# EAGLE design 2Timer (EAGLE 9.2.0)
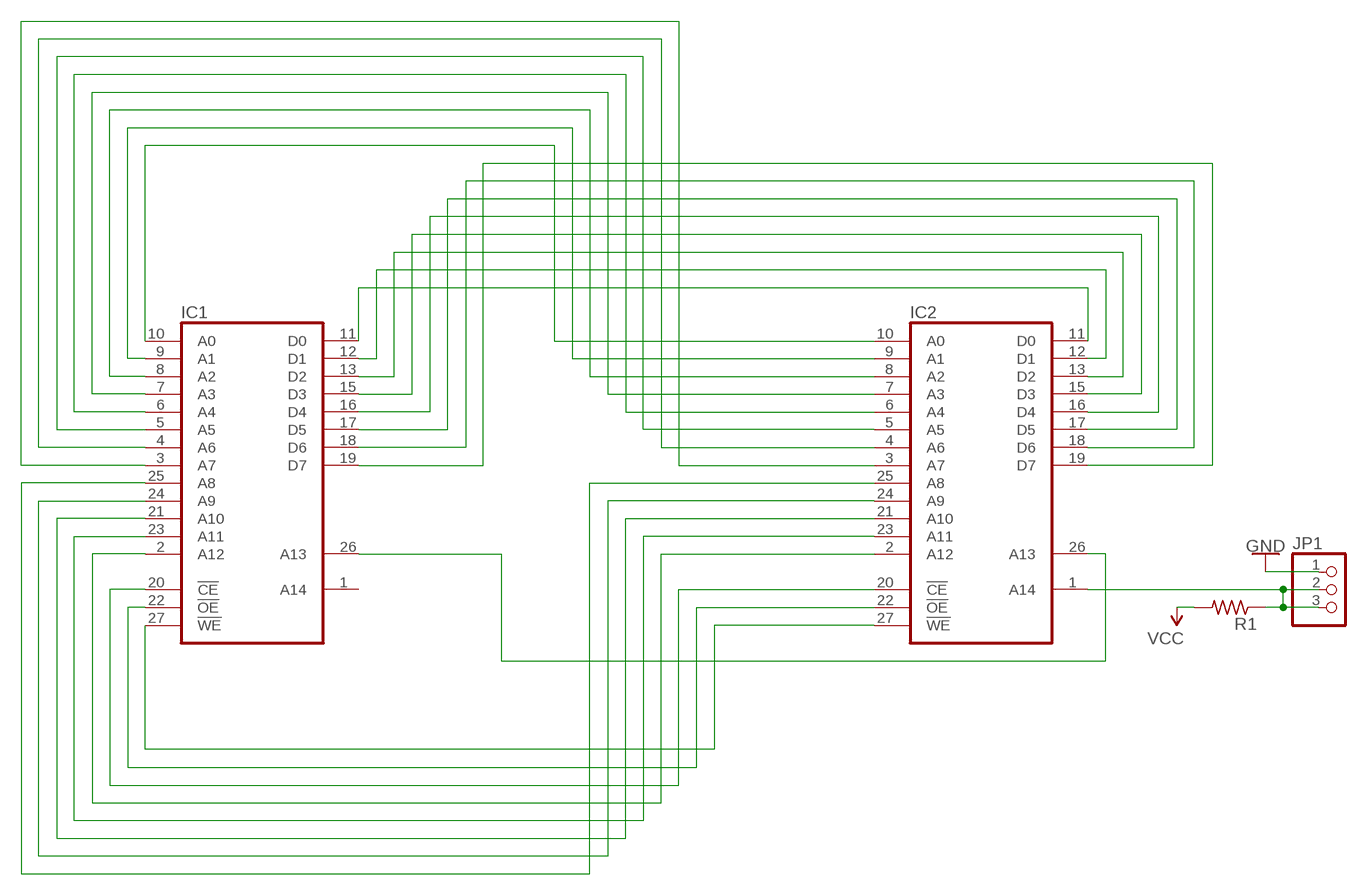
[diagram p0: schematic, sheet 1]

## Parts
IC1  2864  [DIL28]
IC2  2864  [DIL28]
JP1  PINHD-1X3/90  [1X03/90]
R1  R-US_0204/5  [0204/5]

## Nets
GND: JP1.1
N$1: IC1.20(!CE) IC2.20(!CE)
N$2: IC1.11(D0) IC2.11(D0)
N$3: IC1.12(D1) IC2.12(D1)
N$4: IC1.13(D2) IC2.13(D2)
N$5: IC1.23(A11) IC2.23(A11)
N$6: IC1.15(D3) IC2.15(D3)
N$7: IC1.16(D4) IC2.16(D4)
N$8: IC1.17(D5) IC2.17(D5)
N$9: IC1.18(D6) IC2.18(D6)
N$10: IC1.19(D7) IC2.19(D7)
N$11: IC1.26(A13) IC2.26(A13)
N$12: IC1.10(A0) IC2.10(A0)
N$13: IC1.9(A1) IC2.9(A1)
N$14: IC1.8(A2) IC2.8(A2)
N$15: IC1.7(A3) IC2.7(A3)
N$16: IC1.6(A4) IC2.6(A4)
N$17: IC1.5(A5) IC2.5(A5)
N$18: IC1.4(A6) IC2.4(A6)
N$19: IC1.3(A7) IC2.3(A7)
N$20: IC1.25(A8) IC2.25(A8)
N$21: IC1.24(A9) IC2.24(A9)
N$22: IC1.2(A12) IC2.2(A12)
N$23: IC1.21(A10) IC2.21(A10)
N$24: IC1.22(!OE) IC2.22(!OE)
N$25: IC1.27(!WE) IC2.27(!WE)
N$26: IC2.1(A14) JP1.2 JP1.3 R1.1
VCC: R1.2
Unconnected: IC1.1(A14)

## Power pins joined to a net without a drawn wire
GND: IC1.14(GND) IC2.14(GND)
VCC: IC1.28(VCC) IC2.28(VCC)

## Library data of the parts
IC1 IC2 = modded_memory:2864: MEMORY
JP1 = pinhead:PINHD-1X3: PIN HEADER
R1 = resistor:R-US_: RESISTOR, American symbol

## Net classes
0 default: clearance 0.205 mm

## Board
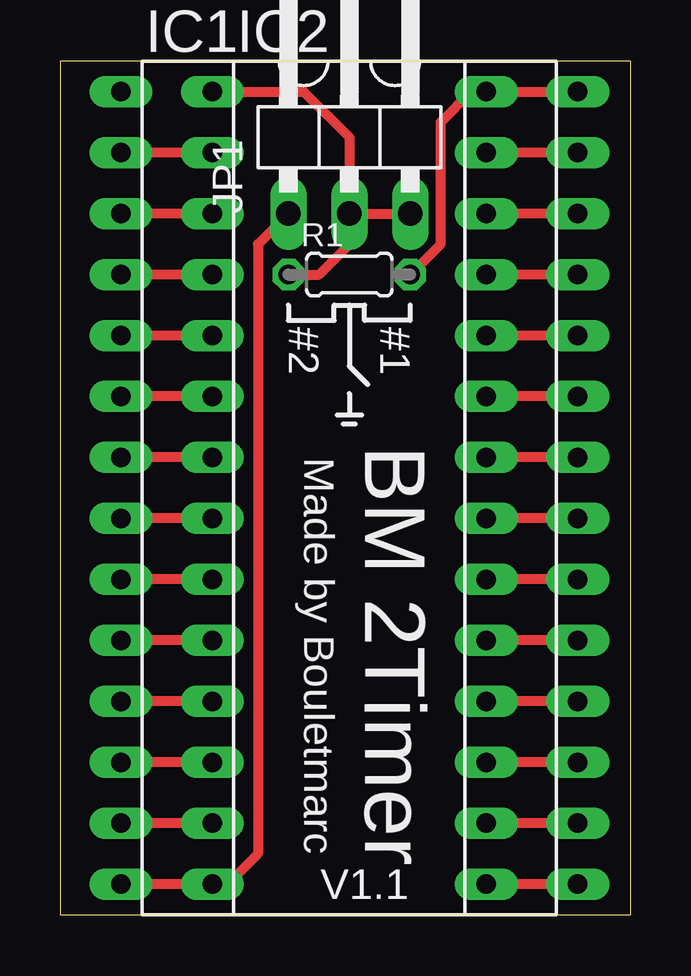
[diagram p1: board, top side]
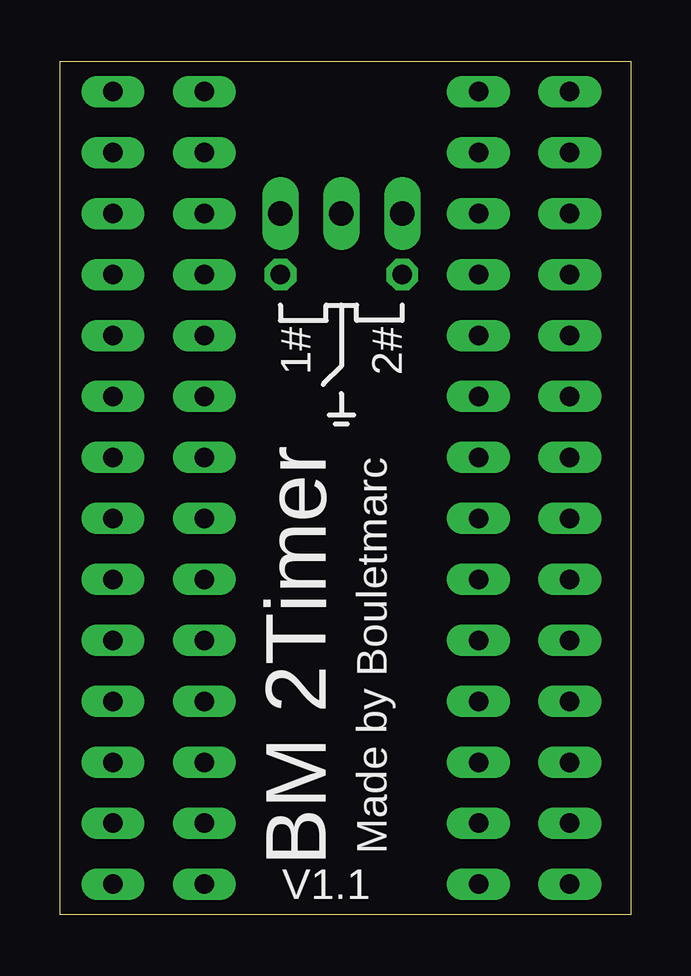
[diagram p2: board, bottom side, seen from below]

Size 23.8 x 35.55 mm. Coordinates in mm from the lower left corner, seen from the top.
Outline: 0,0 23.8,0 23.8,35.55 0,35.55 0,0
Copper layers (1*16): Top 0.035mm / dielectric 1.5mm / Bottom 0.035mm
Design rules "dirt_cheap_dirty_boards.v1.1 *": minimum track width 16mil, minimum drill 12mil, track to track 6mil, track to pad 6mil, pad to pad 6mil, via to via 6mil, smd to smd 0mil, copper to edge 10mil, drill to drill 10mil, minimum pad ring 10mil, minimum via ring 6mil, stop-mask expansion 2mil, vias tented up to drill 25mil, thermal gap 10mil

### Footprints (pad centres in the part's own frame; a part is rotated, then mirrored left to right if it is on the bottom)
DIL28 = drill 0.813 long: 1 -16.51,-7.62; 2 -13.97,-7.62; 3 -11.43,-7.62; 4 -8.89,-7.62; 5 -6.35,-7.62; 6 -3.81,-7.62; 7 -1.27,-7.62; 8 1.27,-7.62; 9 3.81,-7.62; 10 6.35,-7.62; 11 8.89,-7.62; 12 11.43,-7.62; 13 13.97,-7.62; 14 16.51,-7.62; 15 16.51,7.62; 16 13.97,7.62; 17 11.43,7.62; 18 8.89,7.62; 19 6.35,7.62; 20 3.81,7.62; 21 1.27,7.62; 22 -1.27,7.62; 23 -3.81,7.62; 24 -6.35,7.62; 25 -8.89,7.62; 26 -11.43,7.62; 27 -13.97,7.62; 28 -16.51,7.62
1X03/90 = drill 1.016 long: 1 -2.54,-3.81; 2 0,-3.81; 3 2.54,-3.81
0204/5 = drill 0.813 octagon: 1 -2.54,0; 2 2.54,0

### Placement (x,y rotation side)
IC1  10.16,17.78 270 top
IC2  13.97,17.78 270 top
JP1  12.06,33.02 0 top
R1  12.06,26.67 0 top

### Tracks (layer width: path | path; a pad name or v marks a point on that pad's centre or on a via)
GND
  Top 0.406: IC1.14 IC2.14 6.99,1.27 8.26,2.54 8.26,27.94 JP1.1
N$1
  Top 0.406: IC2.20 IC1.20
N$2
  Top 0.406: IC2.11 IC1.11
N$3
  Top 0.406: IC2.12 IC1.12
N$4
  Top 0.406: IC2.13 IC1.13
N$5
  Top 0.406: IC2.23 IC1.23
N$6
  Top 0.406: IC2.15 IC1.15
N$7
  Top 0.406: IC2.16 IC1.16
N$8
  Top 0.406: IC2.17 IC1.17
N$9
  Top 0.406: IC2.18 IC1.18
N$10
  Top 0.406: IC2.19 IC1.19
N$11
  Top 0.406: IC2.26 IC1.26
N$12
  Top 0.406: IC2.10 IC1.10
N$13
  Top 0.406: IC2.9 IC1.9
N$14
  Top 0.406: IC2.8 IC1.8
N$15
  Top 0.406: IC2.7 IC1.7
N$16
  Top 0.406: IC2.6 IC1.6
N$17
  Top 0.406: IC2.5 IC1.5
N$18
  Top 0.406: IC2.4 IC1.4
N$19
  Top 0.406: IC2.3 IC1.3
N$20
  Top 0.406: IC2.25 IC1.25
N$21
  Top 0.406: IC2.24 IC1.24
N$22
  Top 0.406: IC2.2 IC1.2
N$23
  Top 0.406: IC2.21 IC1.21
N$24
  Top 0.406: IC2.22 IC1.22
N$25
  Top 0.406: IC2.27 IC1.27
N$26
  Top 0.406: IC2.1 10.16,34.29 12.06,32.38 JP1.2 | JP1.2 JP1.3 | R1.1 10.79,26.67 12.06,27.94 JP1.2
VCC
  Top 0.406: IC2.28 IC1.28 17.14,34.29 15.88,33.02 15.88,27.94 R1.2

### Text on the board
bPlace: 2# | 1# | Made by Bouletmarc | BM 2Timer | V1.1
tSilk: #2 | #1 | Made by Bouletmarc | BM 2Timer | V1.1